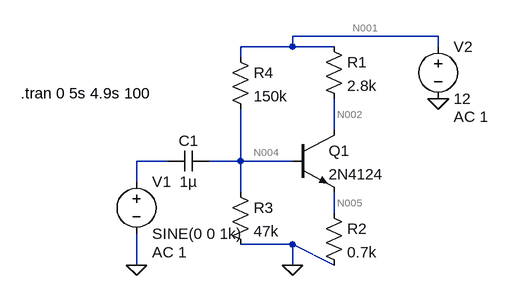
[diagram p0: schematic tranzistor.asc]
tranzistor.asc, the LTspice schematic file:
Version 4
SHEET 1 880 680
WIRE 336 16 112 16
WIRE 112 32 112 16
WIRE 112 32 32 32
WIRE 176 32 112 32
WIRE 336 32 336 16
WIRE 32 48 32 32
WIRE 176 160 176 112
WIRE -80 208 -128 208
WIRE 32 208 32 128
WIRE 32 208 -16 208
WIRE 112 208 32 208
WIRE -128 240 -128 208
WIRE 32 256 32 208
WIRE 176 288 176 256
WIRE 112 336 32 336
WIRE -128 368 -128 320
WIRE 112 368 112 336
WIRE 176 368 112 336
FLAG 112 368 0
FLAG 336 112 0
FLAG -128 368 0
SYMBOL npn 112 160 R0
SYMATTR InstName Q1
SYMATTR Value 2N4124
SYMBOL res 160 16 R0
SYMATTR InstName R1
SYMATTR Value 2.8k
SYMBOL res 160 272 R0
SYMATTR InstName R2
SYMATTR Value 0.7k
SYMBOL res 16 240 R0
SYMATTR InstName R3
SYMATTR Value 47k
SYMBOL res 16 32 R0
SYMATTR InstName R4
SYMATTR Value 150k
SYMBOL voltage -128 224 R0
WINDOW 123 24 124 Left 2
WINDOW 39 0 0 Left 2
SYMATTR InstName V1
SYMATTR Value SINE(0 0 1k)
SYMATTR Value2 AC 1
SYMBOL voltage 336 16 R0
WINDOW 123 24 124 Left 2
WINDOW 39 0 0 Left 2
SYMATTR InstName V2
SYMATTR Value 12
SYMATTR Value2 AC 1
SYMBOL cap -16 192 R90
WINDOW 0 0 32 VBottom 2
WINDOW 3 32 32 VTop 2
SYMATTR InstName C1
SYMATTR Value 1µ
TEXT -306 104 Left 2 !.tran 0 5s 4.9s 100

The netlist it stands for:
* tranzistor.asc
Q1 N002 N004 N005 0 2N4124
R1 N001 N002 2.8k
R2 N005 0 0.7k
R3 N004 0 47k
R4 N001 N004 150k
V1 N003 0 SINE(0 0 1k) AC 1
V2 N001 0 12 AC 1
C1 N004 N003 1µ
.model NPN NPN
.model PNP PNP
.lib standard.bjt
.tran 0 5s 4.9s 100
.backanno
.end

* Results of the author's LTspice run, read from the files saved beside the schematic
* Operating Point, zero values left out:
*   V(n002) = 5.092 V
*   V(n004) = 2.424 V
*   V(n005) = 1.736 V
*   V(n001) = 12 V
*   Ic(Q1) = 2.467 mA
*   Ib(Q1) = 12.25 µA
*   Ie(Q1) = -2.479 mA
*   I(R4) = 63.84 µA
*   I(R3) = 51.58 µA
*   I(R2) = 2.479 mA
*   I(R1) = 2.467 mA
*   I(V2) = -2.531 mA